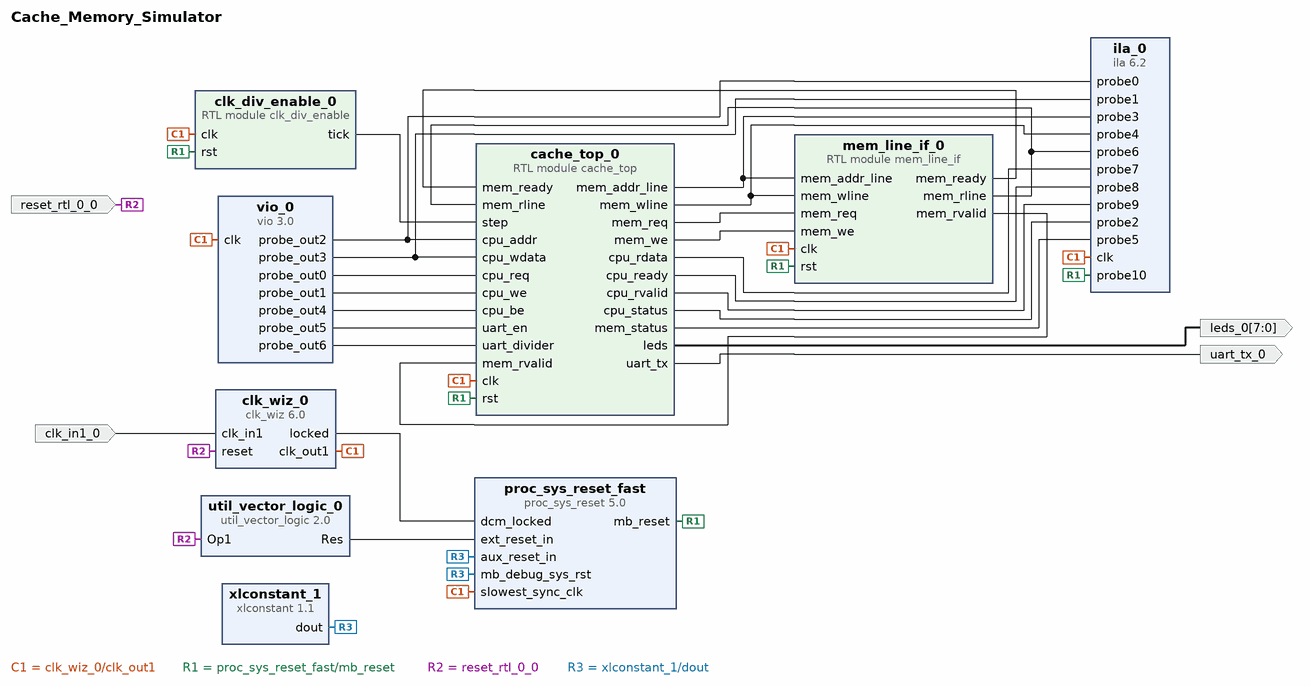
[diagram p0: block diagram of the top level]
# Vivado block design Cache_Memory_Simulator, xc7a35ticpg236-1L, Vivado 2025.1
create_bd_design Cache_Memory_Simulator

create_bd_port -dir I -type clk clk_in1_0
create_bd_port -dir O -from 7 -to 0 leds_0
create_bd_port -dir O uart_tx_0
create_bd_port -dir I -type rst reset_rtl_0_0
set_property -dict {CONFIG.POLARITY ACTIVE_HIGH} [get_bd_ports reset_rtl_0_0]

create_bd_cell -type module -reference cache_top cache_top_0
create_bd_cell -type module -reference mem_line_if mem_line_if_0
create_bd_cell -type module -reference clk_div_enable clk_div_enable_0
create_bd_cell -type ip -vlnv xilinx.com:ip:clk_wiz:6.0 clk_wiz_0
set_property -dict [list \
  CONFIG.CLKOUT1_REQUESTED_OUT_FREQ 100.00000 \
  CONFIG.RESET_PORT reset \
  CONFIG.RESET_TYPE ACTIVE_HIGH \
  CONFIG.USE_LOCKED true \
  CONFIG.USE_RESET true \
] [get_bd_cells clk_wiz_0]
create_bd_cell -type ip -vlnv xilinx.com:ip:vio:3.0 vio_0
set_property -dict [list \
  CONFIG.C_NUM_PROBE_IN 0 \
  CONFIG.C_NUM_PROBE_OUT 7 \
  CONFIG.C_PROBE_OUT2_WIDTH 16 \
  CONFIG.C_PROBE_OUT3_WIDTH 32 \
  CONFIG.C_PROBE_OUT4_WIDTH 4 \
  CONFIG.C_PROBE_OUT6_WIDTH 16 \
] [get_bd_cells vio_0]
create_bd_cell -type ip -vlnv xilinx.com:ip:ila:6.2 ila_0
set_property -dict [list \
  CONFIG.C_MONITOR_TYPE Native \
  CONFIG.C_NUM_OF_PROBES 11 \
  CONFIG.C_PROBE0_WIDTH 32 \
  CONFIG.C_PROBE1_WIDTH 32 \
  CONFIG.C_PROBE2_WIDTH 4 \
  CONFIG.C_PROBE3_WIDTH 32 \
  CONFIG.C_PROBE4_WIDTH 128 \
  CONFIG.C_PROBE5_WIDTH 4 \
  CONFIG.C_PROBE6_WIDTH 128 \
  CONFIG.C_PROBE7_WIDTH 32 \
] [get_bd_cells ila_0]
create_bd_cell -type ip -vlnv xilinx.com:ip:proc_sys_reset:5.0 proc_sys_reset_fast
set_property -dict [list \
  CONFIG.C_AUX_RESET_HIGH 1 \
  CONFIG.C_AUX_RST_WIDTH 1 \
  CONFIG.C_NUM_BUS_RST 1 \
  CONFIG.C_NUM_PERP_RST 1 \
] [get_bd_cells proc_sys_reset_fast]
create_bd_cell -type ip -vlnv xilinx.com:ip:xlconstant:1.1 xlconstant_1
set_property -dict {CONFIG.CONST_VAL 0 CONFIG.CONST_WIDTH 2} [get_bd_cells xlconstant_1]
create_bd_cell -type ip -vlnv xilinx.com:ip:util_vector_logic:2.0 util_vector_logic_0
set_property -dict {CONFIG.C_OPERATION not CONFIG.C_SIZE 1} [get_bd_cells util_vector_logic_0]

# ---- connections ----

connect_bd_net [get_bd_pins vio_0/probe_out2] [get_bd_pins ila_0/probe0] [get_bd_pins cache_top_0/cpu_addr]
connect_bd_net [get_bd_pins vio_0/probe_out3] [get_bd_pins cache_top_0/cpu_wdata] [get_bd_pins ila_0/probe1]
connect_bd_net [get_bd_pins cache_top_0/cpu_rdata] [get_bd_pins ila_0/probe7]
connect_bd_net [get_bd_pins cache_top_0/cpu_ready] [get_bd_pins ila_0/probe8]
connect_bd_net [get_bd_pins cache_top_0/cpu_rvalid] [get_bd_pins ila_0/probe9]
connect_bd_net [get_bd_pins cache_top_0/cpu_status] [get_bd_pins ila_0/probe2]
connect_bd_net [get_bd_pins cache_top_0/leds] [get_bd_ports leds_0]
connect_bd_net [get_bd_pins cache_top_0/mem_addr_line] [get_bd_pins ila_0/probe3] [get_bd_pins mem_line_if_0/mem_addr_line]
connect_bd_net [get_bd_pins cache_top_0/mem_req] [get_bd_pins mem_line_if_0/mem_req]
connect_bd_net [get_bd_pins cache_top_0/mem_status] [get_bd_pins ila_0/probe5]
connect_bd_net [get_bd_pins cache_top_0/mem_we] [get_bd_pins mem_line_if_0/mem_we]
connect_bd_net [get_bd_pins cache_top_0/mem_wline] [get_bd_pins ila_0/probe4] [get_bd_pins mem_line_if_0/mem_wline]
connect_bd_net [get_bd_pins cache_top_0/uart_tx] [get_bd_ports uart_tx_0]
connect_bd_net [get_bd_pins clk_div_enable_0/tick] [get_bd_pins cache_top_0/step]
connect_bd_net -net clk_in1_0_1 [get_bd_ports clk_in1_0] [get_bd_pins clk_wiz_0/clk_in1]
connect_bd_net [get_bd_pins clk_wiz_0/clk_out1] \
  [get_bd_pins proc_sys_reset_fast/slowest_sync_clk] [get_bd_pins mem_line_if_0/clk] [get_bd_pins vio_0/clk] \
  [get_bd_pins cache_top_0/clk] [get_bd_pins ila_0/clk] [get_bd_pins clk_div_enable_0/clk]
connect_bd_net [get_bd_pins clk_wiz_0/locked] [get_bd_pins proc_sys_reset_fast/dcm_locked]
connect_bd_net [get_bd_pins mem_line_if_0/mem_ready] [get_bd_pins cache_top_0/mem_ready]
connect_bd_net [get_bd_pins mem_line_if_0/mem_rline] [get_bd_pins ila_0/probe6] [get_bd_pins cache_top_0/mem_rline]
connect_bd_net [get_bd_pins mem_line_if_0/mem_rvalid] [get_bd_pins cache_top_0/mem_rvalid]
connect_bd_net -net proc_sys_main_mb_reset [get_bd_pins proc_sys_reset_fast/mb_reset] \
  [get_bd_pins mem_line_if_0/rst] [get_bd_pins cache_top_0/rst] [get_bd_pins ila_0/probe10] \
  [get_bd_pins clk_div_enable_0/rst]
connect_bd_net -net reset_rtl_0_0_1 [get_bd_ports reset_rtl_0_0] [get_bd_pins clk_wiz_0/reset] [get_bd_pins util_vector_logic_0/Op1]
connect_bd_net [get_bd_pins util_vector_logic_0/Res] [get_bd_pins proc_sys_reset_fast/ext_reset_in]
connect_bd_net [get_bd_pins vio_0/probe_out0] [get_bd_pins cache_top_0/cpu_req]
connect_bd_net [get_bd_pins vio_0/probe_out1] [get_bd_pins cache_top_0/cpu_we]
connect_bd_net [get_bd_pins vio_0/probe_out4] [get_bd_pins cache_top_0/cpu_be]
connect_bd_net [get_bd_pins vio_0/probe_out5] [get_bd_pins cache_top_0/uart_en]
connect_bd_net [get_bd_pins vio_0/probe_out6] [get_bd_pins cache_top_0/uart_divider]
connect_bd_net [get_bd_pins xlconstant_1/dout] [get_bd_pins proc_sys_reset_fast/aux_reset_in] [get_bd_pins proc_sys_reset_fast/mb_debug_sys_rst]

validate_bd_design
save_bd_design
